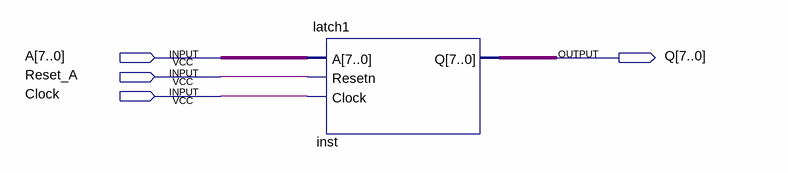
[diagram p0: schematic sheet]
// Quartus schematic latch.bdf as structural Verilog: 1 symbols, 4 pins
module latch (
  input  [7:0] A,
  input  Reset_A,
  input  Clock,
  output [7:0] Q
);

  latch1 inst (.A(A), .Resetn(Reset_A), .Clock(Clock), .Q(Q));
endmodule
